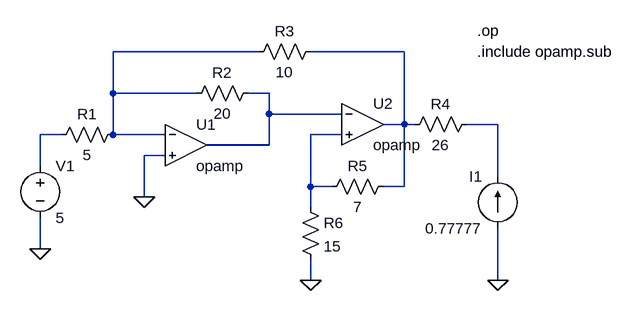
[diagram p0: schematic ej_semana_3_b.asc]
ej_semana_3_b.asc, the LTspice schematic file:
Version 4
SHEET 1 880 680
WIRE 208 112 -16 112
WIRE 432 112 288 112
WIRE -16 176 -16 112
WIRE 112 176 -16 176
WIRE 224 176 192 176
WIRE 224 208 224 176
WIRE 336 208 224 208
WIRE 432 224 432 112
WIRE 432 224 400 224
WIRE 448 224 432 224
WIRE 576 224 528 224
WIRE -96 240 -128 240
WIRE -16 240 -16 176
WIRE 64 240 -16 240
WIRE 336 240 288 240
WIRE 224 256 224 208
WIRE 224 256 128 256
WIRE 64 272 32 272
WIRE -128 288 -128 240
WIRE 576 304 576 224
WIRE 288 320 288 240
WIRE 320 320 288 320
WIRE 432 320 432 224
WIRE 432 320 400 320
WIRE 32 336 32 272
WIRE 288 352 288 320
WIRE -128 416 -128 368
WIRE 288 464 288 432
WIRE 576 464 576 384
FLAG -128 416 0
FLAG 32 336 0
FLAG 288 464 0
FLAG 576 464 0
SYMBOL Opamps/opamp 96 192 R0
SYMATTR InstName U1
SYMBOL Opamps/opamp 368 160 R0
SYMATTR InstName U2
SYMBOL res 0 224 R90
WINDOW 0 0 56 VBottom 2
WINDOW 3 32 56 VTop 2
SYMATTR InstName R1
SYMATTR Value 5
SYMBOL res 208 160 R90
WINDOW 0 0 56 VBottom 2
WINDOW 3 32 56 VTop 2
SYMATTR InstName R2
SYMATTR Value 20
SYMBOL res 304 96 R90
WINDOW 0 0 56 VBottom 2
WINDOW 3 32 56 VTop 2
SYMATTR InstName R3
SYMATTR Value 10
SYMBOL res 544 208 R90
WINDOW 0 0 56 VBottom 2
WINDOW 3 32 56 VTop 2
SYMATTR InstName R4
SYMATTR Value 26
SYMBOL res 304 336 R270
WINDOW 0 32 56 VTop 2
WINDOW 3 0 56 VBottom 2
SYMATTR InstName R5
SYMATTR Value 7
SYMBOL res 272 336 R0
SYMATTR InstName R6
SYMATTR Value 15
SYMBOL voltage -128 272 R0
SYMATTR InstName V1
SYMATTR Value 5
SYMBOL current 576 384 R180
WINDOW 0 24 80 Left 2
WINDOW 3 24 0 Left 2
SYMATTR InstName I1
SYMATTR Value 0.77777
TEXT 544 80 Left 2 !.op
TEXT 544 112 Left 2 !.include opamp.sub

The netlist it stands for:
* ej_semana_3_b.asc
XU1 N001 0 N003 opamp Aol=100K GBW=10Meg  ; pins invin noninvin out
XU2 N003 N006 N002 opamp Aol=100K GBW=10Meg  ; pins invin noninvin out
R1 N001 N005 5
R2 N003 N001 20
R3 N002 N001 10
R4 N004 N002 26
R5 N006 N002 7
R6 N006 0 15
V1 N005 0 5
I1 0 N004 0.77777
.op
.include opamp.sub
.backanno
.end